# EAGLE design untitled (EAGLE 7.6.0)
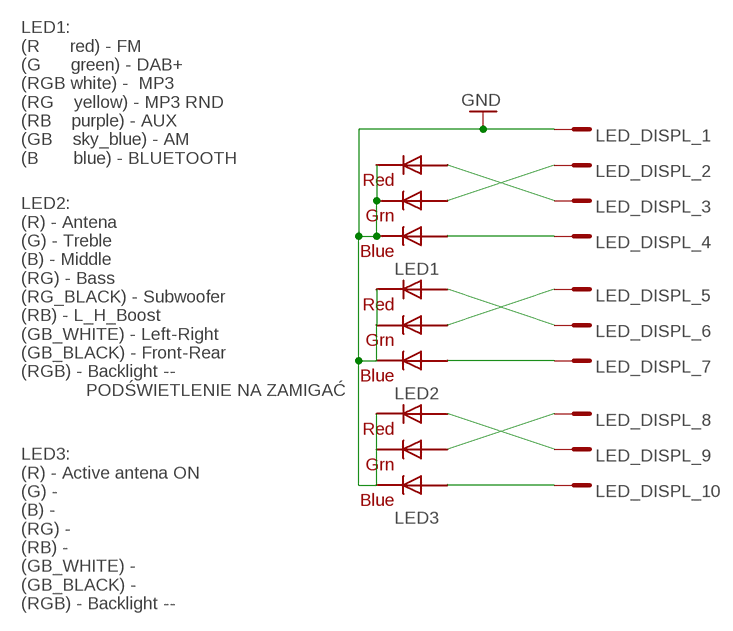
[diagram p0: schematic, sheet 1]

## Parts
LED1  RGBLED5050  [RGBLED5050]
LED2  RGBLED5050  [RGBLED5050]
LED3  RGBLED5050  [RGBLED5050]
LED_DISPL  JST_10_PIN_B10B-PH-SM4-TB  [S10B-PH-SM4-TB]

## Nets
GND: LED1.4(BLUE_C) LED1.5(RED_C) LED1.6(GREEN_C) LED2.4(BLUE_C) LED2.5(RED_C) LED2.6(GREEN_C) LED3.4(BLUE_C) LED3.5(RED_C) LED3.6(GREEN_C) LED_DISPL.P$1
N$10: LED2.3(BLUE_A) LED_DISPL.P$7
N$16: LED1.3(BLUE_A) LED_DISPL.P$4
N$38: LED2.2(RED_A) LED_DISPL.P$6
N$39: LED2.1(GREEN_A) LED_DISPL.P$5
N$42: LED3.2(RED_A) LED_DISPL.P$9
N$45: LED3.1(GREEN_A) LED_DISPL.P$8
N$47: LED1.2(RED_A) LED_DISPL.P$3
N$48: LED1.1(GREEN_A) LED_DISPL.P$2
N$60: LED3.3(BLUE_A) LED_DISPL.P$10

## Notes on the sheet
- LED1:
  (R      red) - FM
  (G      green) - DAB+
  (RGB white) -  MP3
  (RG    yellow) - MP3 RND
  (RB    purple) - AUX
  (GB    sky_blue) - AM
  (B       blue) - BLUETOOTH
- LED2:
  (R) - Antena
  (G) - Treble
  (B) - Middle
  (RG) - Bass
  (RG_BLACK) - Subwoofer
  (RB) - L_H_Boost
  (GB_WHITE) - Left-Right
  (GB_BLACK) - Front-Rear
  (RGB) - Backlight -- 
               PODŚWIETLENIE NA ZAMIGAĆ
- LED3:
  (R) - Active antena ON
  (G) - 
  (B) - 
  (RG) - 
  (RB) - 
  (GB_WHITE) - 
  (GB_BLACK) - 
  (RGB) - Backlight --

## Library data of the parts
LED1-LED3 = adafruit:RGBLED: For 5050 RGB LEDs, the order of the LEDs may vary from one manufacturer to another!
LED_DISPL = conn-JST:JST_10_PIN_

## Board
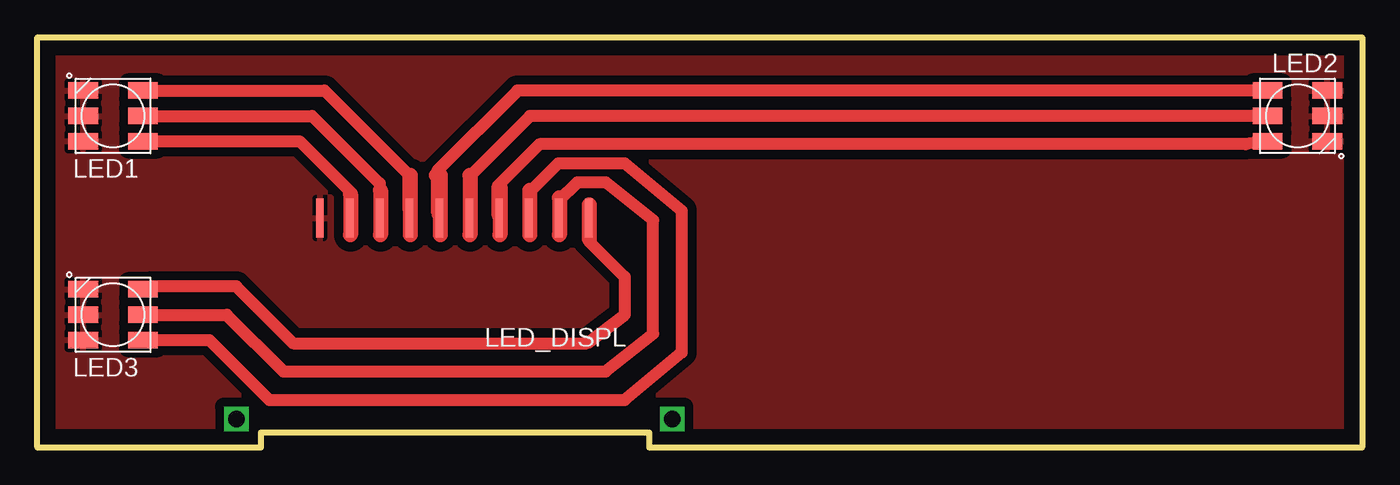
[diagram p1: board, top side]
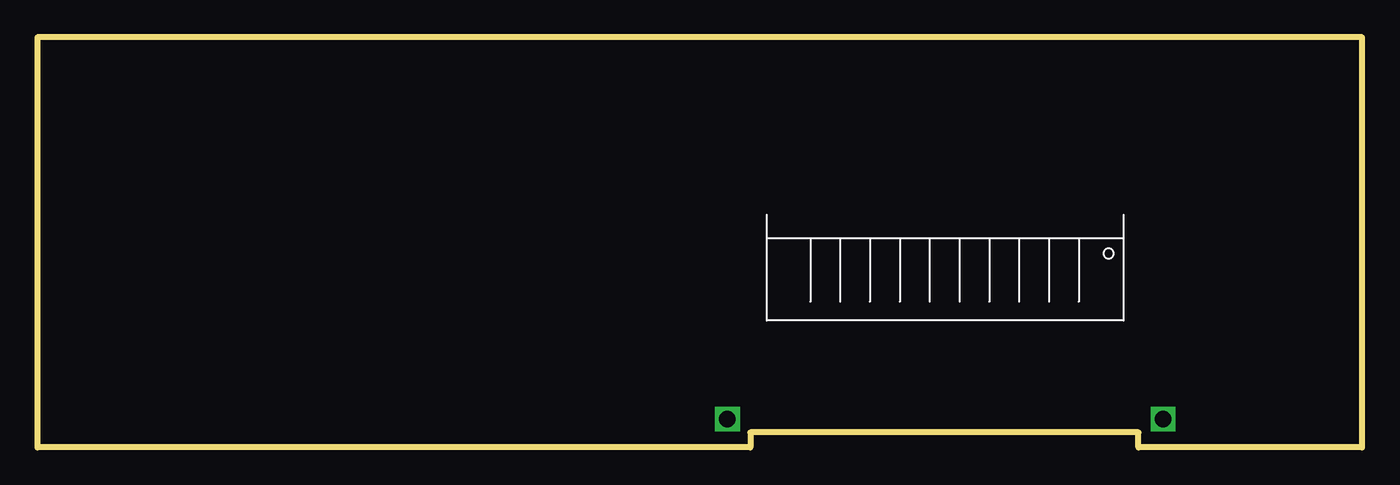
[diagram p2: board, bottom side, seen from below]

Size 88.8 x 27.5 mm. Coordinates in mm from the lower left corner, seen from the top.
Outline: 0,0 15,0 15,1 41,1 41,0 88.8,0 88.8,27.5 0,27.5 0,0
Copper layers (1*16): Top 0.035mm / dielectric 1.5mm / Bottom 0.035mm
Design rules "default": minimum track width 10mil, minimum drill 24mil, track to track 8mil, track to pad 8mil, pad to pad 8mil, via to via 8mil, smd to smd 8mil, copper to edge 40mil, drill to drill 8mil, minimum pad ring 10mil, minimum via ring 8mil, stop-mask expansion 4mil, vias tented up to drill 0mil, thermal gap 10mil

### Footprints (pad centres in the part's own frame; a part is rotated, then mirrored left to right if it is on the bottom)
RGBLED5050 = smd 2 x 1.1: 1 -2,1.7; 2 -2,0; 3 -2,-1.7; 4 2,-1.7; 5 2,0; 6 2,1.7
S10B-PH-SM4-TB = smd 0.5 x 2.6: P$1 -2.95,-1.37; P$2 -4.95,-1.37; P$3 -6.95,-1.37; P$4 -8.95,-1.37; P$5 -10.95,-1.37; P$6 -12.95,-1.37; P$7 -14.95,-1.37; P$8 -16.95,-1.37; P$9 -18.95,-1.37; P$10 -20.95,-1.37

### Placement (x,y rotation side)
LED1  5.08,22.23 180 top
LED2  84.45,22.23 0 top
LED3  5.08,8.89 180 top
LED_DISPL  16,14 180 top

### Tracks (layer width: path | path; a pad name or v marks a point on that pad's centre or on a via)
GND
  pour Top (isolate 0.61): -1.27,27.94 90.17,27.94 90.17,-1.27 -1.27,-1.27
N$1
  Top 1.016: 21,17 21,14.25
N$2
  Top 1.016: 23,17.25 23,14.25
N$3
  Top 1.016: 25,18.25 25,14.25
N$4
  Top 1.016: 26.75,18.25 27,18.25 27,14.25
N$5
  Top 1.016: 29,18.25 29,14.25
N$6
  Top 1.016: 31,17.5 31,14.25
N$7
  Top 1.016: 33,17.25 33,14.25
N$8
  Top 1.016: 35,16.75 35,14.25
N$9
  Top 1.016: 37,14 37,16.25
N$10
  Top 0.813: LED2.3 80.98,20.32 33.66,20.32 30.86,17.53 30.86,15.54 LED_DISPL.P$7
N$11  (via drill 1.1)
  other vias: 13.34,1.91
N$12  (via drill 1.1)
  other vias: 42.55,1.91
N$16
  Top 0.813: LED1.3 19.25,23.93 24.9,18.28 24.9,16.07 LED_DISPL.P$4
N$38
  Top 0.813: LED2.2 33.02,22.23 28.96,18.16 LED_DISPL.P$6
N$39
  Top 0.813: LED2.1 32.18,23.93 26.8,18.55 26.8,15.72 LED_DISPL.P$5
N$42
  Top 0.813: LED3.2 12.7,8.89 16.51,5.08 38.1,5.08 41.27,7.62 41.27,15.24 38.1,17.78 36.2,17.78 34.95,16.54 LED_DISPL.P$9
N$45
  Top 0.813: LED_DISPL.P$8 33.02,15.37 33.02,17.14 34.92,19.05 39.37,19.05 43.18,15.88 43.18,6.35 39.37,3.17 15.54,3.17 11.53,7.19 LED3.1
N$47
  Top 0.813: LED1.2 18.41,22.23 22.95,17.69 LED_DISPL.P$3
N$48
  Top 0.813: LED1.1 17.57,20.52 20.95,17.15 LED_DISPL.P$2
N$60
  Top 0.254: 7.62,10.79 LED3.3
  Top 0.813: 7.62,10.79 13.34,10.79 17.14,6.99 36.83,6.99 39.37,8.89 39.37,11.43 36.95,13.85 LED_DISPL.P$10

### Text on the board
Document: FM, DAB+, / MP3 RDN, / AUX | 88.8 x 27.5 mm